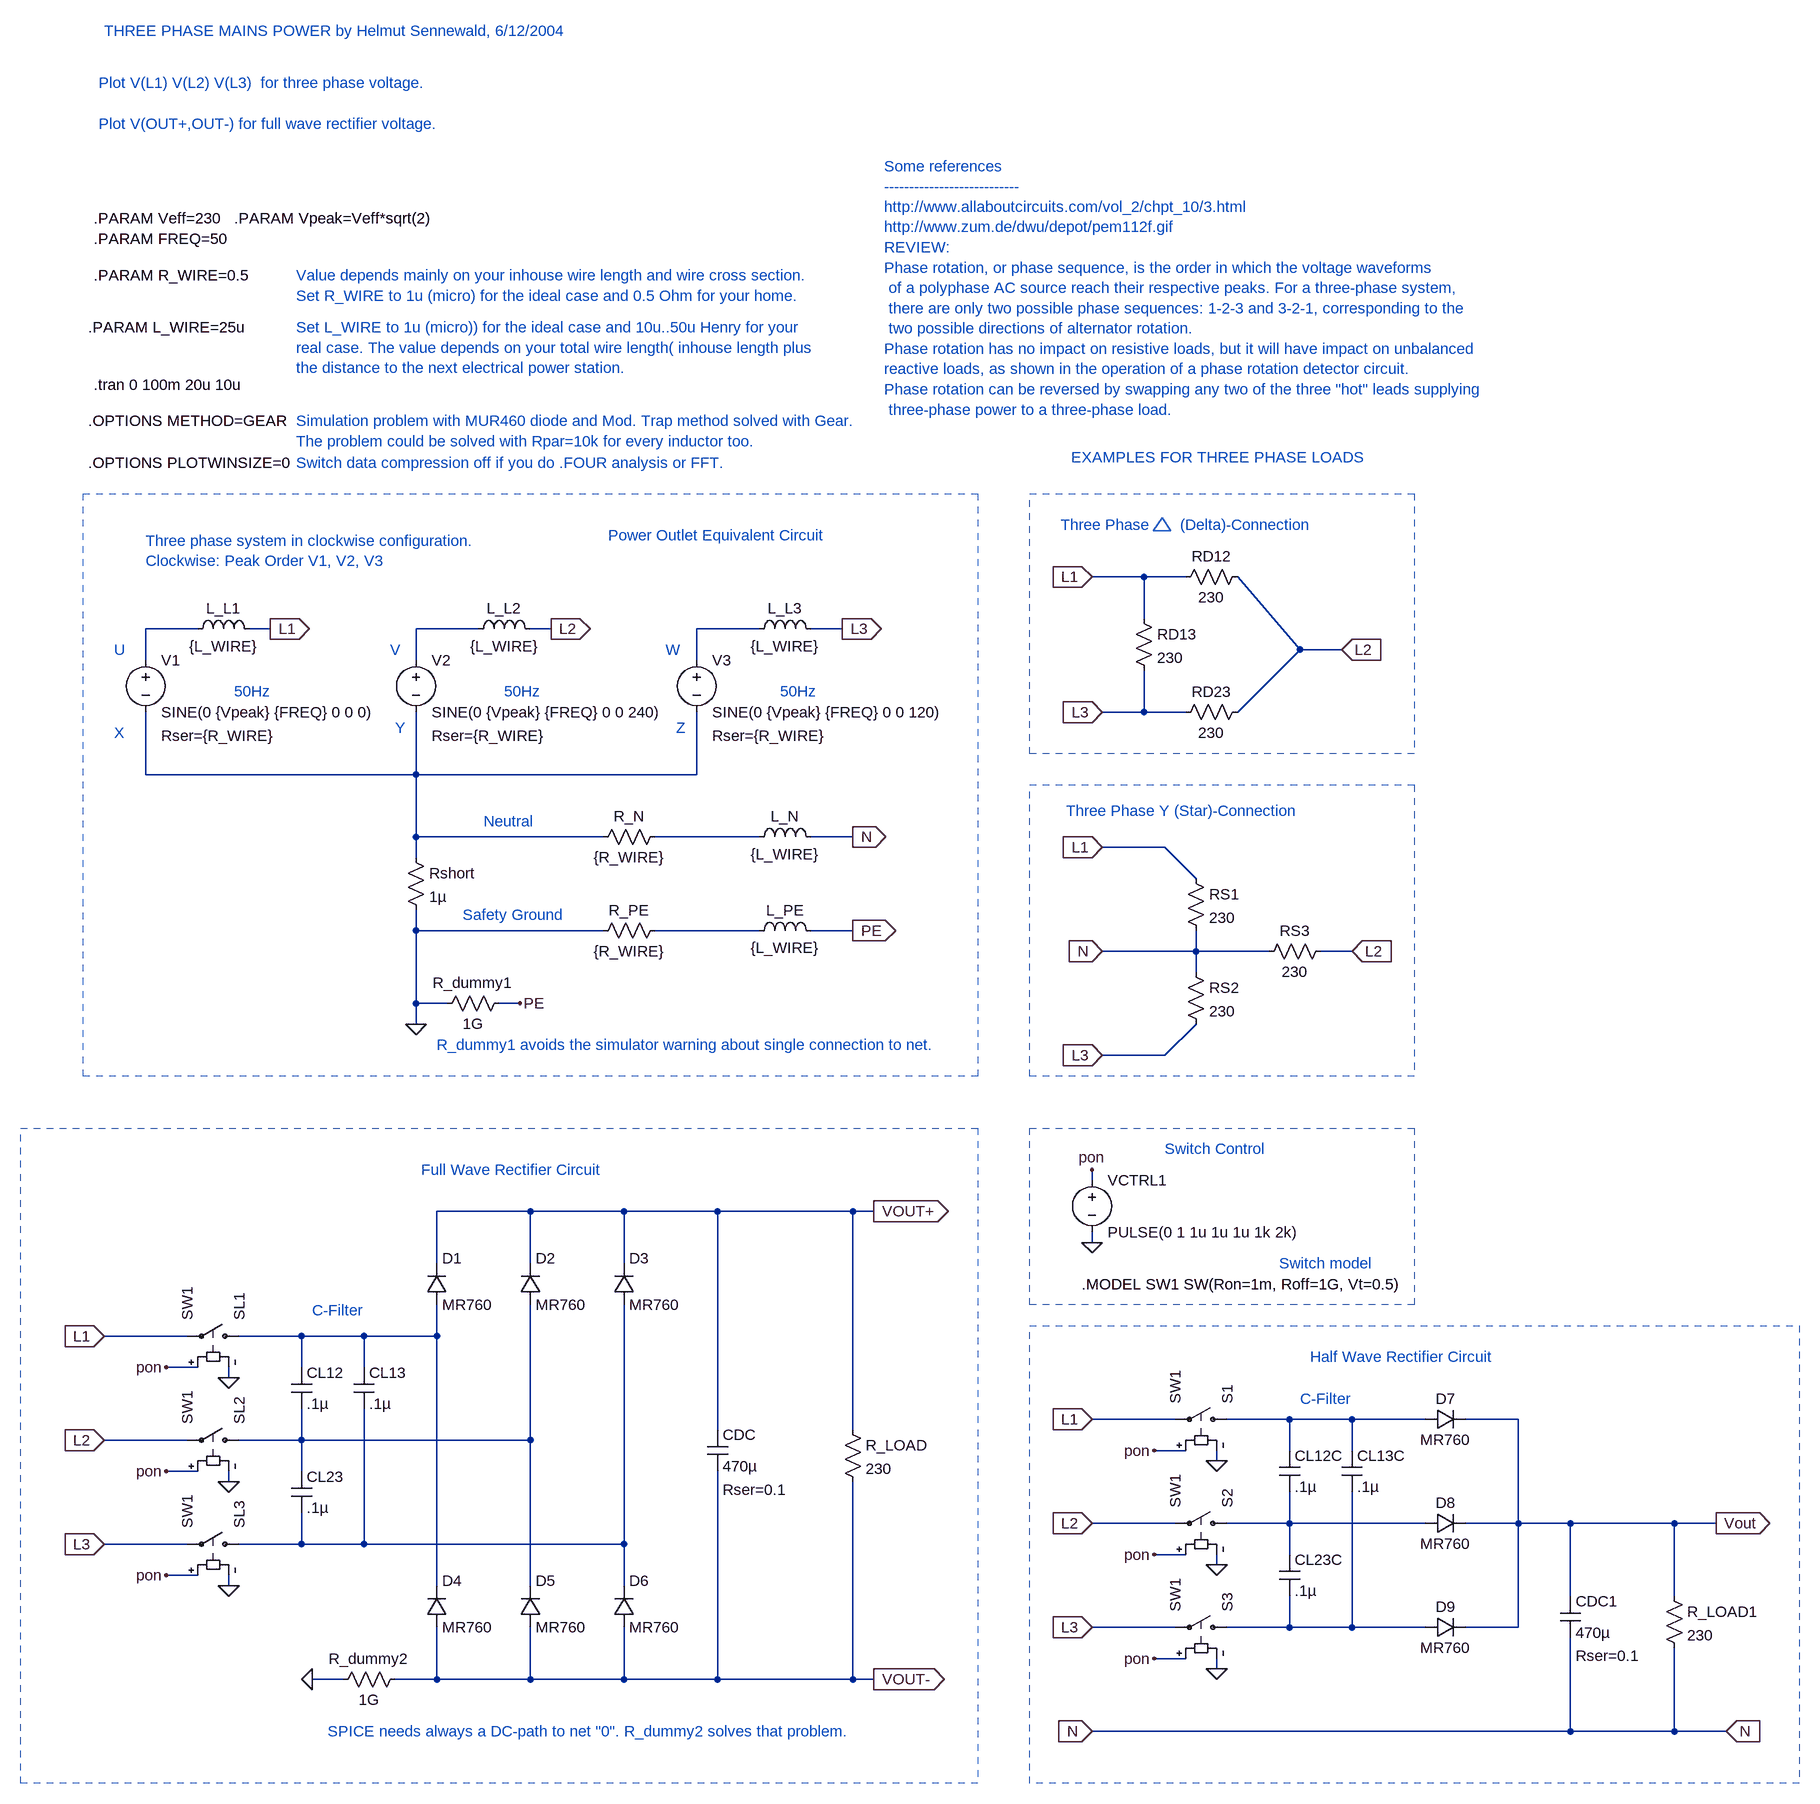
[diagram p0: schematic Three_phase_power.asc]
Three_phase_power.asc, the LTspice schematic file:
Version 4
SHEET 1 3156 2100
WIRE 544 48 464 48
WIRE 608 48 544 48
WIRE 544 112 544 48
WIRE -912 128 -992 128
WIRE -800 128 -832 128
WIRE -480 128 -576 128
WIRE -368 128 -400 128
WIRE -48 128 -144 128
WIRE 80 128 32 128
WIRE 784 160 688 48
WIRE 848 160 784 160
WIRE -992 176 -992 128
WIRE -576 176 -576 128
WIRE -144 176 -144 128
WIRE 544 256 544 192
WIRE 544 256 480 256
WIRE 608 256 544 256
WIRE 688 256 784 160
WIRE -992 352 -992 256
WIRE -576 352 -576 256
WIRE -576 352 -992 352
WIRE -144 352 -144 256
WIRE -144 352 -576 352
WIRE -576 448 -576 352
WIRE -288 448 -576 448
WIRE -48 448 -208 448
WIRE 96 448 32 448
WIRE 576 464 480 464
WIRE -576 480 -576 448
WIRE 624 512 576 464
WIRE -576 592 -576 560
WIRE -288 592 -576 592
WIRE -48 592 -208 592
WIRE 96 592 32 592
WIRE 624 624 624 592
WIRE 624 624 480 624
WIRE 736 624 624 624
WIRE 864 624 816 624
WIRE 624 656 624 624
WIRE -576 704 -576 592
WIRE -528 704 -576 704
WIRE -416 704 -448 704
WIRE -576 736 -576 704
WIRE 576 784 624 736
WIRE 576 784 480 784
WIRE 464 976 464 960
WIRE -400 1024 -544 1024
WIRE -256 1024 -400 1024
WIRE -112 1024 -256 1024
WIRE 96 1024 -112 1024
WIRE 128 1024 96 1024
WIRE 464 1072 464 1056
WIRE -544 1104 -544 1024
WIRE -400 1104 -400 1024
WIRE -256 1104 -256 1024
WIRE -928 1216 -1056 1216
WIRE -752 1216 -848 1216
WIRE -656 1216 -752 1216
WIRE -544 1216 -544 1168
WIRE -544 1216 -656 1216
WIRE -912 1264 -960 1264
WIRE -752 1264 -752 1216
WIRE -656 1264 -656 1216
WIRE -864 1280 -864 1264
WIRE 592 1344 464 1344
WIRE 768 1344 672 1344
WIRE 864 1344 768 1344
WIRE 976 1344 864 1344
WIRE 1120 1344 1040 1344
WIRE -112 1360 -112 1024
WIRE 96 1360 96 1024
WIRE -928 1376 -1056 1376
WIRE -752 1376 -752 1328
WIRE -752 1376 -848 1376
WIRE -400 1376 -400 1168
WIRE -400 1376 -752 1376
WIRE 608 1392 560 1392
WIRE 768 1392 768 1344
WIRE 864 1392 864 1344
WIRE 656 1408 656 1392
WIRE -912 1424 -960 1424
WIRE -752 1424 -752 1376
WIRE -864 1440 -864 1424
WIRE 592 1504 464 1504
WIRE 768 1504 768 1456
WIRE 768 1504 672 1504
WIRE 976 1504 768 1504
WIRE 1120 1504 1120 1344
WIRE 1120 1504 1040 1504
WIRE 1200 1504 1120 1504
WIRE 1360 1504 1200 1504
WIRE 1424 1504 1360 1504
WIRE -928 1536 -1056 1536
WIRE -752 1536 -752 1488
WIRE -752 1536 -848 1536
WIRE -656 1536 -656 1328
WIRE -656 1536 -752 1536
WIRE -256 1536 -256 1168
WIRE -256 1536 -656 1536
WIRE 608 1552 560 1552
WIRE 768 1552 768 1504
WIRE 656 1568 656 1552
WIRE -912 1584 -960 1584
WIRE -864 1600 -864 1584
WIRE -544 1600 -544 1216
WIRE -400 1600 -400 1376
WIRE -256 1600 -256 1536
WIRE 1200 1616 1200 1504
WIRE 1360 1616 1360 1504
WIRE 592 1664 464 1664
WIRE 768 1664 768 1616
WIRE 768 1664 672 1664
WIRE 864 1664 864 1456
WIRE 864 1664 768 1664
WIRE 976 1664 864 1664
WIRE 1120 1664 1120 1504
WIRE 1120 1664 1040 1664
WIRE 608 1712 560 1712
WIRE 656 1728 656 1712
WIRE -688 1744 -736 1744
WIRE -544 1744 -544 1664
WIRE -544 1744 -608 1744
WIRE -400 1744 -400 1664
WIRE -400 1744 -544 1744
WIRE -256 1744 -256 1664
WIRE -256 1744 -400 1744
WIRE -112 1744 -112 1424
WIRE -112 1744 -256 1744
WIRE 96 1744 96 1440
WIRE 96 1744 -112 1744
WIRE 128 1744 96 1744
WIRE 1200 1824 1200 1680
WIRE 1200 1824 464 1824
WIRE 1360 1824 1360 1696
WIRE 1360 1824 1200 1824
WIRE 1440 1824 1360 1824
FLAG -800 128 L1
IOPIN -800 128 Out
FLAG 80 128 L3
IOPIN 80 128 Out
FLAG -368 128 L2
IOPIN -368 128 Out
FLAG -576 736 0
FLAG 464 48 L1
IOPIN 464 48 In
FLAG 480 256 L3
IOPIN 480 256 In
FLAG 848 160 L2
IOPIN 848 160 In
FLAG 480 464 L1
IOPIN 480 464 In
FLAG 864 624 L2
IOPIN 864 624 In
FLAG 480 784 L3
IOPIN 480 784 In
FLAG 480 624 N
IOPIN 480 624 In
FLAG 96 448 N
IOPIN 96 448 Out
FLAG 96 592 PE
IOPIN 96 592 Out
FLAG -416 704 PE
FLAG 464 1664 L3
IOPIN 464 1664 In
FLAG 464 1504 L2
IOPIN 464 1504 In
FLAG 464 1344 L1
IOPIN 464 1344 In
FLAG 464 1824 N
IOPIN 464 1824 In
FLAG 656 1408 0
FLAG 656 1568 0
FLAG 656 1728 0
FLAG 560 1392 pon
FLAG 560 1552 pon
FLAG 560 1712 pon
FLAG 464 1072 0
FLAG 464 960 pon
FLAG -1056 1536 L3
IOPIN -1056 1536 In
FLAG -1056 1376 L2
IOPIN -1056 1376 In
FLAG -1056 1216 L1
IOPIN -1056 1216 In
FLAG -864 1280 0
FLAG -864 1440 0
FLAG -864 1600 0
FLAG -960 1264 pon
FLAG -960 1424 pon
FLAG -960 1584 pon
FLAG -736 1744 0
FLAG 128 1024 VOUT+
IOPIN 128 1024 Out
FLAG 128 1744 VOUT-
IOPIN 128 1744 Out
FLAG 1424 1504 Vout
IOPIN 1424 1504 Out
FLAG 1440 1824 N
IOPIN 1440 1824 In
SYMBOL voltage -992 160 R0
WINDOW 123 0 0 Left 0
WINDOW 39 24 132 Left 0
SYMATTR SpiceLine Rser={R_WIRE}
SYMATTR InstName V1
SYMATTR Value SINE(0 {Vpeak} {FREQ} 0 0 0)
SYMBOL voltage -144 160 R0
WINDOW 123 0 0 Left 0
WINDOW 39 24 132 Left 0
SYMATTR SpiceLine Rser={R_WIRE}
SYMATTR InstName V3
SYMATTR Value SINE(0 {Vpeak} {FREQ} 0 0 120)
SYMBOL voltage -576 160 R0
WINDOW 123 0 0 Left 0
WINDOW 39 24 132 Left 0
SYMATTR SpiceLine Rser={R_WIRE}
SYMATTR InstName V2
SYMATTR Value SINE(0 {Vpeak} {FREQ} 0 0 240)
SYMBOL res 528 96 R0
SYMATTR InstName RD13
SYMATTR Value 230
SYMBOL res 592 64 R270
WINDOW 0 32 56 VTop 0
WINDOW 3 0 56 VBottom 0
SYMATTR InstName RD12
SYMATTR Value 230
SYMBOL res 592 272 R270
WINDOW 0 32 56 VTop 0
WINDOW 3 0 56 VBottom 0
SYMATTR InstName RD23
SYMATTR Value 230
SYMBOL res 608 496 R0
SYMATTR InstName RS1
SYMATTR Value 230
SYMBOL res 608 640 R0
SYMATTR InstName RS2
SYMATTR Value 230
SYMBOL res 720 640 R270
WINDOW 0 32 56 VTop 0
WINDOW 3 0 56 VBottom 0
SYMATTR InstName RS3
SYMATTR Value 230
SYMBOL res -304 464 R270
WINDOW 0 32 56 VTop 0
WINDOW 3 0 56 VBottom 0
SYMATTR InstName R_N
SYMATTR Value {R_WIRE}
SYMBOL res -304 608 R270
WINDOW 0 32 56 VTop 0
WINDOW 3 0 56 VBottom 0
SYMATTR InstName R_PE
SYMATTR Value {R_WIRE}
SYMBOL res -592 464 R0
SYMATTR InstName Rshort
SYMATTR Value 1µ
SYMBOL res -544 720 R270
WINDOW 0 32 56 VTop 0
WINDOW 3 0 56 VBottom 0
SYMATTR InstName R_dummy1
SYMATTR Value 1G
SYMBOL res 1344 1600 R0
SYMATTR InstName R_LOAD1
SYMATTR Value 230
SYMBOL cap 1184 1616 R0
WINDOW 39 24 92 Left 0
SYMATTR SpiceLine Rser=0.1
SYMATTR InstName CDC1
SYMATTR Value 470µ
SYMBOL sw 688 1344 M270
SYMATTR InstName S1
SYMATTR Value SW1
SYMBOL sw 688 1504 M270
SYMATTR InstName S2
SYMATTR Value SW1
SYMBOL sw 688 1664 M270
SYMATTR InstName S3
SYMATTR Value SW1
SYMBOL voltage 464 960 R0
WINDOW 123 0 0 Left 0
WINDOW 39 0 0 Left 0
SYMATTR InstName VCTRL1
SYMATTR Value PULSE(0 1 1u 1u 1u 1k 2k)
SYMBOL res 80 1344 R0
SYMATTR InstName R_LOAD
SYMATTR Value 230
SYMBOL cap -128 1360 R0
WINDOW 39 24 92 Left 0
SYMATTR SpiceLine Rser=0.1
SYMATTR InstName CDC
SYMATTR Value 470µ
SYMBOL sw -832 1216 M270
SYMATTR InstName SL1
SYMATTR Value SW1
SYMBOL sw -832 1376 M270
SYMATTR InstName SL2
SYMATTR Value SW1
SYMBOL sw -832 1536 M270
SYMATTR InstName SL3
SYMATTR Value SW1
SYMBOL diode -560 1168 M180
WINDOW 0 24 72 Left 0
WINDOW 3 24 0 Left 0
SYMATTR InstName D1
SYMATTR Value MR760
SYMBOL res -704 1760 R270
WINDOW 0 32 56 VTop 0
WINDOW 3 0 56 VBottom 0
SYMATTR InstName R_dummy2
SYMATTR Value 1G
SYMBOL ind -496 144 R270
WINDOW 0 32 56 VTop 0
WINDOW 3 5 56 VBottom 0
SYMATTR InstName L_L2
SYMATTR Value {L_WIRE}
SYMATTR SpiceLine Rser=1m Rpar=1e6
SYMBOL ind -64 144 R270
WINDOW 0 32 56 VTop 0
WINDOW 3 5 56 VBottom 0
SYMATTR InstName L_L3
SYMATTR Value {L_WIRE}
SYMATTR SpiceLine Rser=1m Rpar=1e6
SYMBOL ind -928 144 R270
WINDOW 0 32 56 VTop 0
WINDOW 3 5 56 VBottom 0
SYMATTR InstName L_L1
SYMATTR Value {L_WIRE}
SYMATTR SpiceLine Rser=1m Rpar=1e6
SYMBOL cap -768 1264 R0
SYMATTR InstName CL12
SYMATTR Value .1µ
SYMATTR SpiceLine Rser=0.1
SYMBOL cap -768 1424 R0
SYMATTR InstName CL23
SYMATTR Value .1µ
SYMATTR SpiceLine Rser=0.1
SYMBOL cap -672 1264 R0
SYMATTR InstName CL13
SYMATTR Value .1µ
SYMATTR SpiceLine Rser=0.1
SYMBOL cap 752 1392 R0
SYMATTR InstName CL12C
SYMATTR Value .1µ
SYMATTR SpiceLine Rser=0.1
SYMBOL cap 752 1552 R0
SYMATTR InstName CL23C
SYMATTR Value .1µ
SYMATTR SpiceLine Rser=0.1
SYMBOL cap 848 1392 R0
SYMATTR InstName CL13C
SYMATTR Value .1µ
SYMATTR SpiceLine Rser=0.1
SYMBOL ind -64 464 R270
WINDOW 0 32 56 VTop 0
WINDOW 3 5 56 VBottom 0
SYMATTR InstName L_N
SYMATTR Value {L_WIRE}
SYMATTR SpiceLine Rser=1m Rpar=1e6
SYMBOL ind -64 608 R270
WINDOW 0 32 56 VTop 0
WINDOW 3 5 56 VBottom 0
SYMATTR InstName L_PE
SYMATTR Value {L_WIRE}
SYMATTR SpiceLine Rser=1m Rpar=1e6
SYMBOL diode -416 1168 M180
WINDOW 0 24 72 Left 0
WINDOW 3 24 0 Left 0
SYMATTR InstName D2
SYMATTR Value MR760
SYMBOL diode -272 1168 M180
WINDOW 0 24 72 Left 0
WINDOW 3 24 0 Left 0
SYMATTR InstName D3
SYMATTR Value MR760
SYMBOL diode -560 1664 M180
WINDOW 0 24 72 Left 0
WINDOW 3 24 0 Left 0
SYMATTR InstName D4
SYMATTR Value MR760
SYMBOL diode -416 1664 M180
WINDOW 0 24 72 Left 0
WINDOW 3 24 0 Left 0
SYMATTR InstName D5
SYMATTR Value MR760
SYMBOL diode -272 1664 M180
WINDOW 0 24 72 Left 0
WINDOW 3 24 0 Left 0
SYMATTR InstName D6
SYMATTR Value MR760
SYMBOL diode 976 1328 M90
WINDOW 0 0 32 VBottom 0
WINDOW 3 32 32 VTop 0
SYMATTR InstName D7
SYMATTR Value MR760
SYMBOL diode 976 1488 M90
WINDOW 0 0 32 VBottom 0
WINDOW 3 32 32 VTop 0
SYMATTR InstName D8
SYMATTR Value MR760
SYMBOL diode 976 1648 M90
WINDOW 0 0 32 VBottom 0
WINDOW 3 32 32 VTop 0
SYMATTR InstName D9
SYMATTR Value MR760
TEXT -1072 -248 Left 0 !.tran 0 100m 20u 10u
TEXT -992 -8 Left 0 ;Three phase system in clockwise configuration.\nClockwise: Peak Order V1, V2, V3
TEXT 144 -584 Left 0 ;Some references\n---------------------------\nhttp://www.allaboutcircuits.com/vol_2/chpt_10/3.html\nhttp://www.zum.de/dwu/depot/pem112f.gif\nREVIEW: \nPhase rotation, or phase sequence, is the order in which the voltage waveforms\n of a polyphase AC source reach their respective peaks. For a three-phase system,\n there are only two possible phase sequences: 1-2-3 and 3-2-1, corresponding to the\n two possible directions of alternator rotation. \nPhase rotation has no impact on resistive loads, but it will have impact on unbalanced \nreactive loads, as shown in the operation of a phase rotation detector circuit. \nPhase rotation can be reversed by swapping any two of the three "hot" leads supplying\n three-phase power to a three-phase load.
TEXT -504 568 Left 0 ;Safety Ground
TEXT -1072 -416 Left 0 !.PARAM R_WIRE=0.5
TEXT -760 -416 Left 0 ;Value depends mainly on your inhouse wire length and wire cross section.\nSet R_WIRE to 1u (micro) for the ideal case and 0.5 Ohm for your home.
TEXT -1040 160 Left 0 ;U
TEXT -616 160 Left 0 ;V
TEXT -192 160 Left 0 ;W
TEXT -1040 288 Left 0 ;X
TEXT -608 280 Left 0 ;Y
TEXT -176 280 Left 0 ;Z
TEXT -472 424 Left 0 ;Neutral
TEXT 424 408 Left 0 ;Three Phase Y (Star)-Connection
TEXT 416 -32 Left 0 ;Three Phase
TEXT 600 -32 Left 0 ;(Delta)-Connection
TEXT -544 768 Left 0 ;R_dummy1 avoids the simulator warning about single connection to net.
TEXT 800 1248 Left 0 ;Half Wave Rectifier Circuit
TEXT 448 1136 Left 0 !.MODEL SW1 SW(Ron=1m, Roff=1G, Vt=0.5)
TEXT -568 960 Left 0 ;Full Wave Rectifier Circuit
TEXT 752 1104 Left 0 ;Switch model
TEXT -712 1824 Left 0 ;SPICE needs always a DC-path to net "0". R_dummy2 solves that problem.
TEXT -856 224 Left 0 ;50Hz
TEXT -440 224 Left 0 ;50Hz
TEXT -16 224 Left 0 ;50Hz
TEXT -1080 -336 Left 0 !.PARAM L_WIRE=25u
TEXT -760 -336 Left 0 ;Set L_WIRE to 1u (micro)) for the ideal case and 10u..50u Henry for your \nreal case. The value depends on your total wire length( inhouse length plus \nthe distance to the next electrical power station.
TEXT -1080 -128 Left 0 !.OPTIONS PLOTWINSIZE=0
TEXT 576 928 Left 0 ;Switch Control
TEXT -1080 -192 Left 0 !.OPTIONS METHOD=GEAR
TEXT -280 -16 Left 0 ;Power Outlet Equivalent Circuit
TEXT -760 -192 Left 0 ;Simulation problem with MUR460 diode and Mod. Trap method solved with Gear.\nThe problem could be solved with Rpar=10k for every inductor too.
TEXT -760 -128 Left 0 ;Switch data compression off if you do .FOUR analysis or FFT.
TEXT -1056 -792 Left 0 ;THREE PHASE MAINS POWER by Helmut Sennewald, 6/12/2004
TEXT -1072 -504 Left 0 !.PARAM Veff=230
TEXT -856 -504 Left 0 !.PARAM Vpeak=Veff*sqrt(2)
TEXT -1072 -472 Left 0 !.PARAM FREQ=50
TEXT 432 -136 Left 0 ;EXAMPLES FOR THREE PHASE LOADS
TEXT -736 1176 Left 0 ;C-Filter
TEXT 784 1312 Left 0 ;C-Filter
TEXT -1064 -712 Left 0 ;Plot V(L1) V(L2) V(L3)  for three phase voltage.\n \nPlot V(OUT+,OUT-) for full wave rectifier voltage.
LINE Normal 572 -43 558 -23
LINE Normal 585 -23 572 -43
LINE Normal 558 -23 585 -23
RECTANGLE Normal 960 1168 368 896 2
RECTANGLE Normal 288 816 -1088 -80 2
RECTANGLE Normal 288 1904 -1184 896 2
RECTANGLE Normal 1552 1904 368 1200 2
RECTANGLE Normal 960 816 368 368 2
RECTANGLE Normal 960 320 368 -80 2

The netlist it stands for:
* Three_phase_power.asc
V1 N001 N004 SINE(0 {Vpeak} {FREQ} 0 0 0) Rser={R_WIRE}
V3 N003 N004 SINE(0 {Vpeak} {FREQ} 0 0 120) Rser={R_WIRE}
V2 N002 N004 SINE(0 {Vpeak} {FREQ} 0 0 240) Rser={R_WIRE}
RD13 L1 L3 230
RD12 L1 L2 230
RD23 L3 L2 230
RS1 L1 N 230
RS2 N L3 230
RS3 N L2 230
R_N N004 N005 {R_WIRE}
R_PE 0 N006 {R_WIRE}
Rshort N004 0 1µ
R_dummy1 0 PE 1G
R_LOAD1 Vout N 230
CDC1 Vout N 470µ Rser=0.1
S1 N008 L1 pon 0 SW1
S2 N010 L2 pon 0 SW1
S3 N012 L3 pon 0 SW1
VCTRL1 pon 0 PULSE(0 1 1u 1u 1u 1k 2k)
R_LOAD VOUT+ VOUT- 230
CDC VOUT+ VOUT- 470µ Rser=0.1
SL1 N007 L1 pon 0 SW1
SL2 N009 L2 pon 0 SW1
SL3 N011 L3 pon 0 SW1
D1 N007 VOUT+ MR760
R_dummy2 0 VOUT- 1G
L_L2 N002 L2 {L_WIRE} Rser=1m Rpar=1e6
L_L3 N003 L3 {L_WIRE} Rser=1m Rpar=1e6
L_L1 N001 L1 {L_WIRE} Rser=1m Rpar=1e6
CL12 N007 N009 .1µ Rser=0.1
CL23 N009 N011 .1µ Rser=0.1
CL13 N007 N011 .1µ Rser=0.1
CL12C N008 N010 .1µ Rser=0.1
CL23C N010 N012 .1µ Rser=0.1
CL13C N008 N012 .1µ Rser=0.1
L_N N005 N {L_WIRE} Rser=1m Rpar=1e6
L_PE N006 PE {L_WIRE} Rser=1m Rpar=1e6
D2 N009 VOUT+ MR760
D3 N011 VOUT+ MR760
D4 VOUT- N007 MR760
D5 VOUT- N009 MR760
D6 VOUT- N011 MR760
D7 N008 Vout MR760
D8 N010 Vout MR760
D9 N012 Vout MR760
.model D D
.lib standard.dio
.tran 0 100m 20u 10u
* Three phase system in clockwise configuration.
* Clockwise: Peak Order V1, V2, V3
* Some references
* ---------------------------
* http://www.allaboutcircuits.com/vol_2/chpt_10/3.html
* http://www.zum.de/dwu/depot/pem112f.gif
* REVIEW:
* Phase rotation, or phase sequence, is the order in which the voltage waveforms
*  of a polyphase AC source reach their respective peaks. For a three-phase system,
*  there are only two possible phase sequences: 1-2-3 and 3-2-1, corresponding to the
*  two possible directions of alternator rotation.
* Phase rotation has no impact on resistive loads, but it will have impact on unbalanced
* reactive loads, as shown in the operation of a phase rotation detector circuit.
* Phase rotation can be reversed by swapping any two of the three "hot" leads supplying
*  three-phase power to a three-phase load.
* Safety Ground
.PARAM R_WIRE=0.5
* Value depends mainly on your inhouse wire length and wire cross section.
* Set R_WIRE to 1u (micro) for the ideal case and 0.5 Ohm for your home.
* U
* V
* W
* X
* Y
* Z
* Neutral
* Three Phase Y (Star)-Connection
* Three Phase
* (Delta)-Connection
* R_dummy1 avoids the simulator warning about single connection to net.
* Half Wave Rectifier Circuit
.MODEL SW1 SW(Ron=1m, Roff=1G, Vt=0.5)
* Full Wave Rectifier Circuit
* Switch model
* SPICE needs always a DC-path to net "0". R_dummy2 solves that problem.
* 50Hz
* 50Hz
* 50Hz
.PARAM L_WIRE=25u
* Set L_WIRE to 1u (micro)) for the ideal case and 10u..50u Henry for your
* real case. The value depends on your total wire length( inhouse length plus
* the distance to the next electrical power station.
.OPTIONS PLOTWINSIZE=0
* Switch Control
.OPTIONS METHOD=GEAR
* Power Outlet Equivalent Circuit
* Simulation problem with MUR460 diode and Mod. Trap method solved with Gear.
* The problem could be solved with Rpar=10k for every inductor too.
* Switch data compression off if you do .FOUR analysis or FFT.
* THREE PHASE MAINS POWER by Helmut Sennewald, 6/12/2004
.PARAM Veff=230
.PARAM Vpeak=Veff*sqrt(2)
.PARAM FREQ=50
* EXAMPLES FOR THREE PHASE LOADS
* C-Filter
* C-Filter
* Plot V(L1) V(L2) V(L3)  for three phase voltage.
* Plot V(OUT+,OUT-) for full wave rectifier voltage.
.backanno
.end